# Altium project 220_energy_meter.PrjPCB
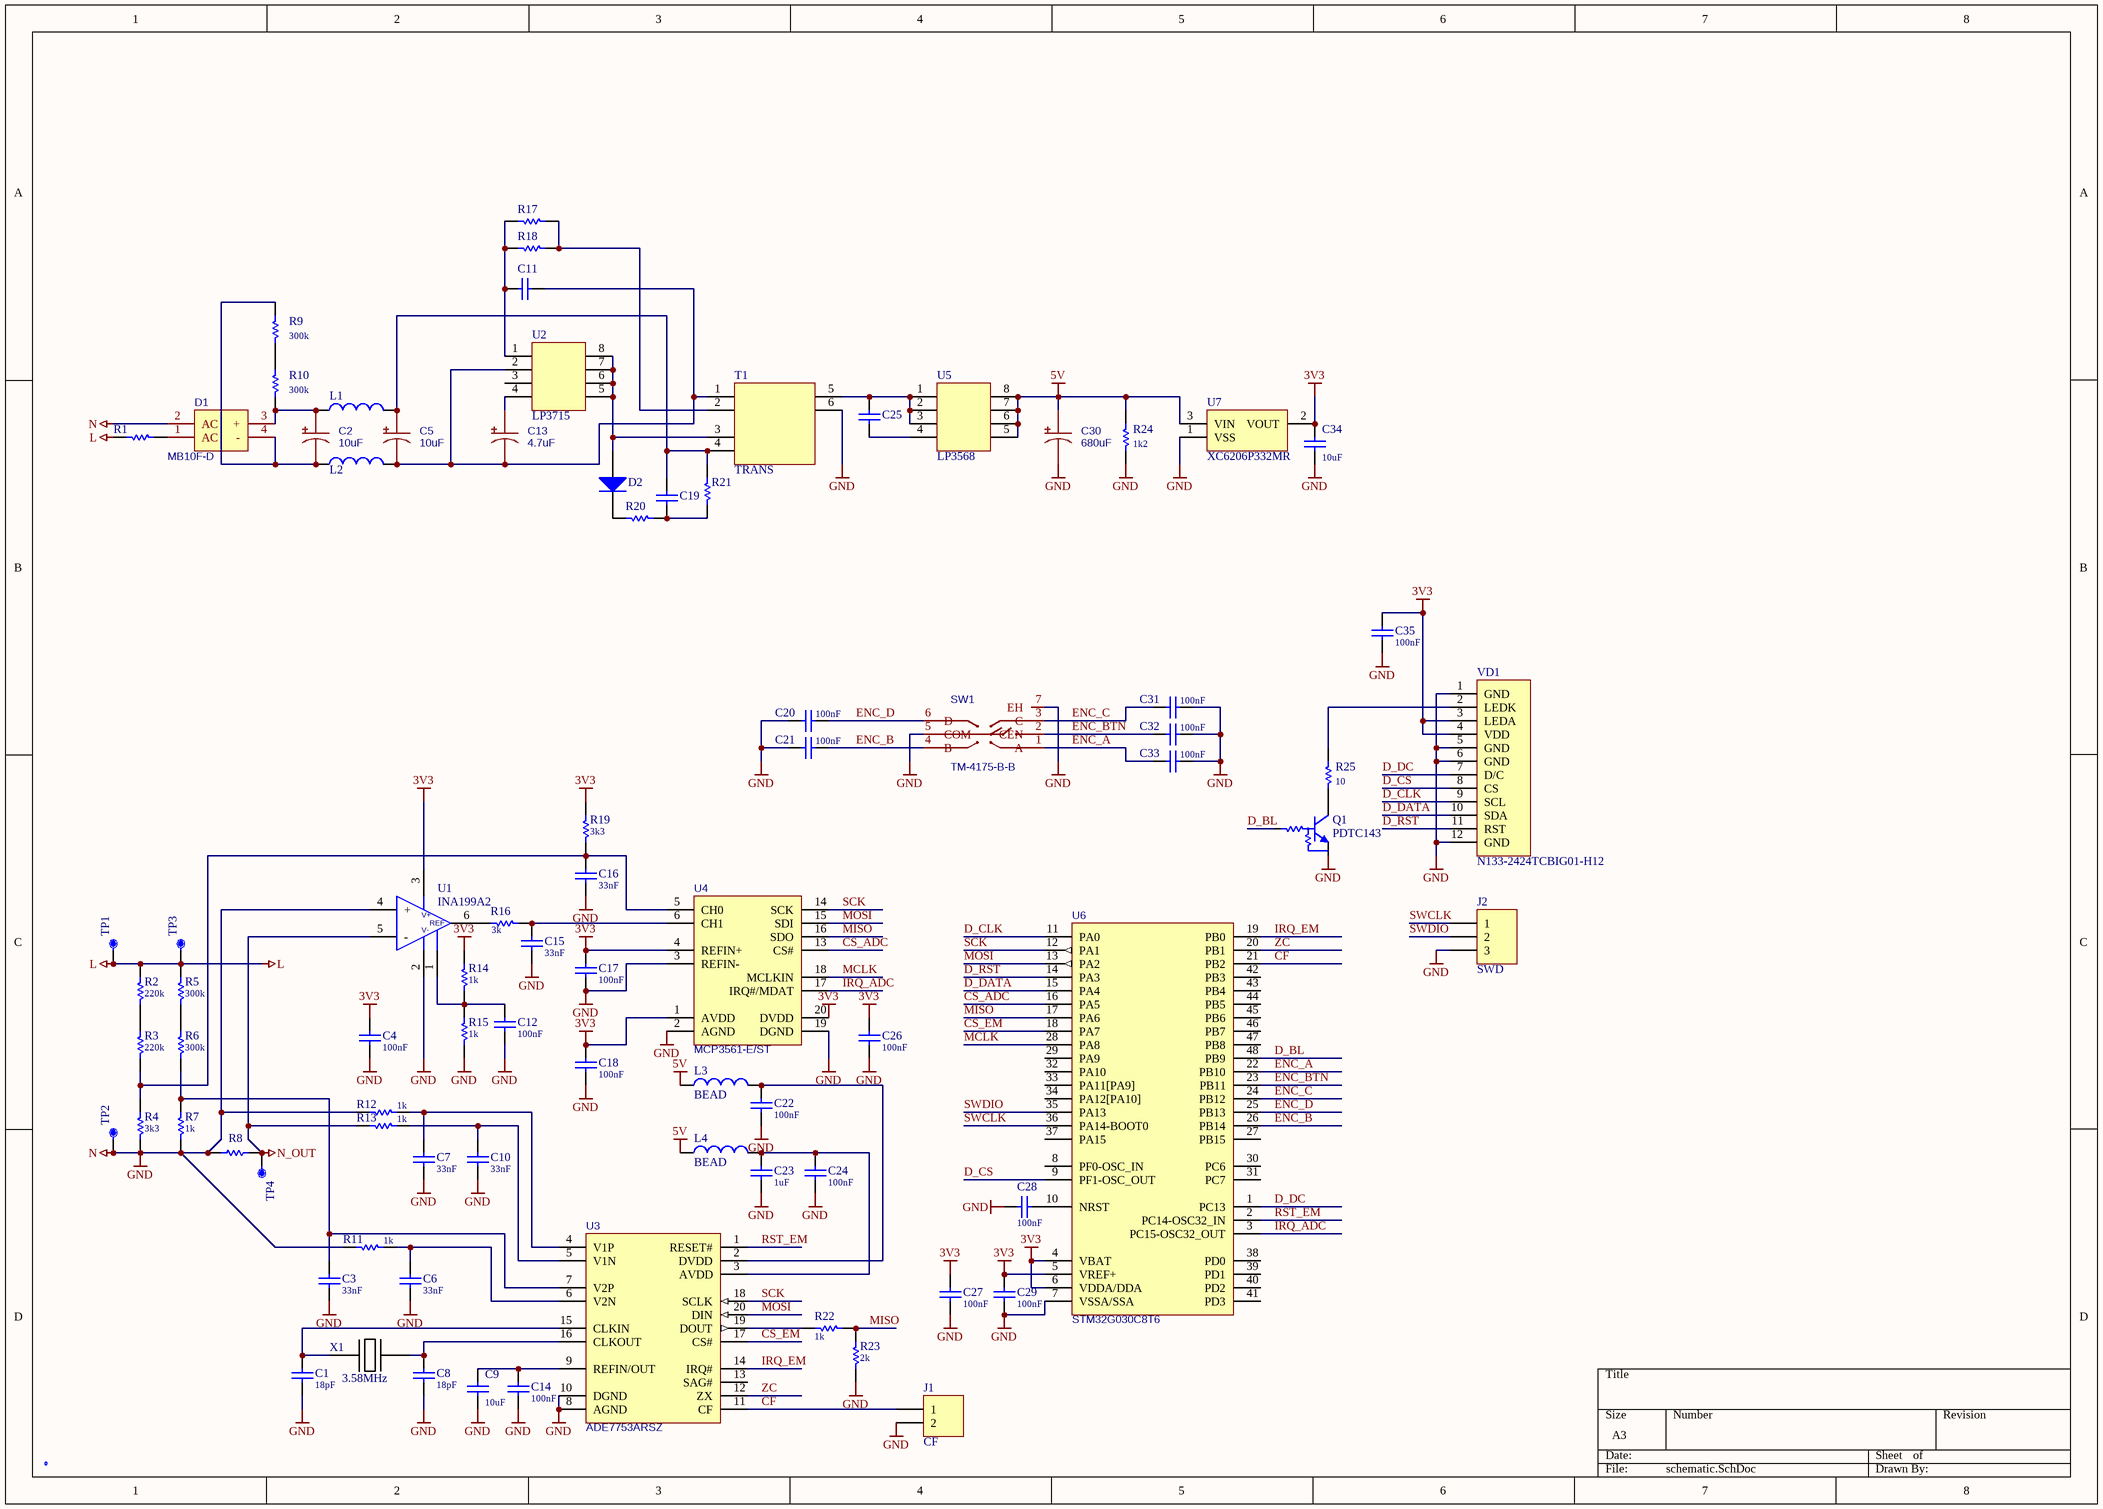
[diagram p0: schematic.SchDoc]
PRJ_ID: 220_EM; PRJ_VER: v2.0.0
1 sheet, 85 parts. Net scope: global (net labels, ports and power ports of the same name join across sheets).
Board file: board.PcbDoc

## Sheet schematic.SchDoc
size A3; SheetNumber: 6; SheetTotal: 29

### Parts
C1  18pF  [C0402]
C2  10uF  [CAP-TH_BD8.0-P3.50-D0.6-FD_1]  (no BOM)
C3  33nF  [C0402]
C4  100nF  [C0402]
C5  10uF  [CAP-TH_BD8.0-P3.50-D0.6-FD_1]  (no BOM)
C6  33nF  [C0402]
C7  33nF  [C0402]
C8  18pF  [C0402]
C9  10uF  [C1206]
C10  33nF  [C0402]
C11  (no value)  [C0603]  (no BOM)
C12  100nF  [C0402]
C13  4.7uF  [CAP-TH_BD4.0-P2]  (no BOM)
C14  100nF  [C0402]
C15  33nF  [C0402]
C16  33nF  [C0402]
C17  100nF  [C0402]
C18  100nF  [C0402]
C19  (no value)  [C1206]  (no BOM)
C20  100nF  [C0402]
C21  100nF  [C0402]
C22  100nF  [C0402]
C23  1uF  [C0603]
C24  100nF  [C0402]
C25  (no value)  [C0603]  (no BOM)
C26  100nF  [C0402]
C27  100nF  [C0402]
C28  100nF  [C0603]
C29  100nF  [C0402]
C30  680uF  [CAP-TH_BD6.3-P2.54]  (no BOM)
C31  100nF  [C0402]
C32  100nF  [C0402]
C33  100nF  [C0402]
C34  10uF  [C1206]
C35  100nF  [C0402]
D1  MB10F-D  [MINIDIP_4P-L4.7-W3.8-P2.50-LS7.0-BL]  (no BOM)
D2  1N4148WS  [SOD-123]  (value not drawn)  (no BOM)
J1  CF  [HDR-1X2_2.54]  (no BOM)
J2  SWD  [HDR-1X3_2.54]  (no BOM)
L1  (no value)  [IND_TH]  (no BOM)
L2  (no value)  [L0805]  (no BOM)
L3  BEAD  [L0402]
L4  BEAD  [L0402]
LOGO1  LOGO  [LOGO]  (value not drawn)  (no BOM)
Q1  PDTC143  [SOT-23]
R1  (no value)  [IND_TH]  (no BOM)
R2  220k  [R1206]
R3  220k  [R1206]
R4  3k3  [R0603]
R5  300k  [R1206]
R6  300k  [R1206]
R7  1k  [R0603]
R8  (no value)  [R2512-WIDE]
R9  300k  [R1206]
R10  300k  [R1206]
R11  1k  [R0603]
R12  1k  [R0603]
R13  1k  [R0603]
R14  1k  [R0603]
R15  1k  [R0603]
R16  3k  [R0603]
R17  (no value)  [R0603]  (no BOM)
R18  (no value)  [R0603]  (no BOM)
R19  3k3  [R0603]
R20  (no value)  [R0805]  (no BOM)
R21  (no value)  [R1206]  (no BOM)
R22  1k  [R0402]
R23  2k  [R0402]
R24  1k2  [R1206]  (no BOM)
R25  10  [R0603]
SW1  TM-4175-B-B  [SW-SMD_TM-4175-B-X]
T1  TRANS  [TRANSFORMER]  (no BOM)
TP1  (no value)  [TP2030_SMD]  (no BOM)
TP2  (no value)  [TP2030_SMD]  (no BOM)
TP3  (no value)  [TP2030_SMD]  (no BOM)
TP4  (no value)  [TP2030_SMD]  (no BOM)
U1  INA199A2  [SOT-363]
U2  LP3715  [SOIC-8]  (no BOM)
U3  ADE7753ARSZ  [SSOP-20]
U4  MCP3561-E/ST  [SSOP-20]
U5  LP3568  [SOIC-8]  (no BOM)
U6  STM32G030C8T6  [LQFP-48]
U7  XC6206P332MR  [SOT-23]
VD1  N133-2424TCBIG01-H12  [LCD_PICO_1.3]  (no BOM)
X1  3.58MHz  [HC-49S-SMD]

### Nets
3V3: C4.2 C17.2 C18.2 C26.2 C27.2 C29.2 C34.2 C35.2 R14.2 R19.1 U1.3(V+) U4.1(AVDD) U4.4(REFIN+) U4.20(DVDD) U6.4(VBAT) U6.5(VREF+) U6.6(VDDA/DDA) U7.2(VOUT) VD1.3(LEDA) VD1.4(VDD)
5V: C30.1 L3.1 L4.1 R24.2 U5.5 U5.6 U5.7 U5.8 U7.3(VIN)
GND: C1.1 C3.1 C4.1 C6.1 C7.1 C8.1 C9.1 C10.1 C12.1 C14.1 C15.1 C16.1 C17.1 C18.1 C20.2 C21.2 C22.1 C23.1 C24.2 C26.1 C27.1 C28.2 C29.1 C30.2 C31.1 C32.1 C33.1 C34.1 C35.1 D1.2(AC) J1.2 J2.3 Q1.2(E) R4.2 R7.2 R8.2 R11.2 R12.2 R15.1 R23.2 R24.1 SW1.5(COM) SW1.7(EH) T1.6 TP2.1 U1.2(GND) U1.4(+) U3.8(AGND) U3.10(DGND) U4.2(AGND) U4.3(REFIN-) U4.19(DGND) U6.7(VSSA/SSA) U7.1(VSS) VD1.1(GND) VD1.5(GND) VD1.6(GND) VD1.12(GND)  [also labelled N]
L: R1.2 R2.1 R5.1 TP1.1 TP3.1
N_OUT: R8.1 R13.2 TP4.1 U1.5(-)
CF: J1.1 U3.11(CF) U6.21(PB2)
CS_ADC: U4.13(CS#) U6.16(PA5)
CS_EM: U3.17(CS#) U6.18(PA7)
D_BL: Q1.1(B) U6.48(PB9)
D_CLK: U6.11(PA0) VD1.9(SCL)
D_CS: U6.9(PF1-OSC_OUT) VD1.8(CS)
D_DATA: U6.15(PA4) VD1.10(SDA)
D_DC: U6.1(PC13) VD1.7(D/C)
D_RST: U6.14(PA3) VD1.11(RST)
ENC_A: C33.2 SW1.1(A) U6.22(PB10)
ENC_B: C21.1 SW1.4(B) U6.26(PB14)
ENC_BTN: C32.2 SW1.2(CEN) U6.23(PB11)
ENC_C: C31.2 SW1.3(C) U6.24(PB12)
ENC_D: C20.1 SW1.6(D) U6.25(PB13)
IRQ_ADC: U4.17(IRQ#/MDAT) U6.3(PC15-OSC32_OUT)
IRQ_EM: U3.14(IRQ#) U6.19(PB0)
MCLK: U4.18(MCLKIN) U6.28(PA8)
MISO: R22.1 R23.1 U4.16(SDO) U6.17(PA6)
MOSI: U3.20(DIN) U4.15(SDI) U6.13(PA2)
RST_EM: U3.1(RESET#) U6.2(PC14-OSC32_IN)
SCK: U3.18(SCLK) U4.14(SCK) U6.12(PA1)
SWCLK: J2.1 U6.36(PA14-BOOT0)
SWDIO: J2.2 U6.35(PA13)
ZC: U3.12(ZX) U6.20(PB1)
NetC1_2: C1.2 U3.15(CLKIN) X1.1(X1)
NetC2_1: C2.1 D1.3(+) L1.2 R10.1
NetC2_2: C2.2 D1.4(-) L2.2 R9.2
NetC3_2: C3.2 R6.2 R7.1 U3.7(V2P)
NetC5_1: C5.1 C19.1 L1.1 R21.2 T1.4
NetC5_2: C5.2 C11.1 C13.2 L2.1 T1.1 U2.2
NetC6_2: C6.2 R11.1 U3.6(V2N)
NetC7_2: C7.2 R12.1 U3.4(V1P)
NetC8_2: C8.2 U3.16(CLKOUT) X1.2(X2)
NetC9_2: C9.2 C14.2 U3.9(REFIN/OUT)
NetC10_2: C10.2 R13.1 U3.5(V1N)
NetC11_2: C11.2 R17.2 R18.2 U2.1
NetC12_2: C12.2 R14.1 R15.2 U1.1(REF)
NetC13_1: C13.1 U2.4
NetC15_2: C15.2 R16.1 U4.6(CH1)
NetC16_2: C16.2 R3.2 R4.1 R19.2 U4.5(CH0)
NetC19_2: C19.2 R20.2 R21.1
NetC22_2: C22.2 L3.2 U3.2(DVDD)
NetC23_2: C23.2 C24.1 L4.2 U3.3(AVDD)
NetC25_1: C25.1 U5.4
NetC25_2: C25.2 T1.5 U5.1 U5.2 U5.3
NetC28_1: C28.1 U6.10(NRST)
NetD1_1: D1.1(AC) R1.1
NetD2_1: D2.1(A) T1.3 U2.5 U2.6 U2.7 U2.8
NetD2_2: D2.2(K) R20.1
NetQ1_3: Q1.3(C) R25.2
NetR2_2: R2.2 R3.1
NetR5_2: R5.2 R6.1
NetR9_1: R9.1 R10.2
NetR16_2: R16.2 U1.6(OUT)
NetR17_1: R17.1 R18.1 T1.2
NetR22_2: R22.2 U3.19(DOUT)
NetR25_1: R25.1 VD1.2(LEDK)

Not connected (* = marked no-connect by the designer): U2 3; U3 13(SAG#); U6 8(PF0-OSC_IN) 27(PB15) 29(PA9) 30(PC6) 31(PC7) 32(PA10) 33(PA11[PA9]) 34(PA12[PA10]) 37(PA15) 38(PD0) 39(PD1) 40(PD2) 41(PD3) 42(PB3) 43(PB4) 44(PB5) 45(PB6) 46(PB7) 47(PB8)

### Notes on the sheet
- (in symbol MCP65R41T-2402) V-

### Library data of the parts
C1 C7 C8 C10 = CAP: P/N: GRM1555C1H180JA01D; LCSC part number: C33149
C2 C5 = 220uF: 01EC4138MHT10uF400V
C3 C4 C6 C9 C11 C12 C14-C22 C24-C29 C31-C35 = CAP
C13 C30 = 220uF
C23 = CAP: 1uF 50V 0603; P/N: 0603B105K500NT; LCSC part number: C90540
D2 = US1M-13-F
J1 = Header 2
J2 = Header 3
L1 L2 = BLM18AG601SN1D
L3 L4 = BLM18AG601SN1D: BEAD 0402; P/N: CBG100505U600T; LCSC part number: C92615
Q1 = MMBT2222ALT1G: PDTC143XT,215; LCSC part number: C183011; P/N: PDTC143XT,215
R1-R25 = RES
T1 = Component_2
TP1-TP4 = TP_Dup1: LCSC part number: -; P/N: -
U1 = MCP65R41T-2402
U2 U5 = Component_1
U7 = Component_4_1
VD1 = Header 3: N133-2424TCBIG01-H12 19650 Waveshare
X1 = CRYSTAL 12MHZ 3.20mm x 2.50mm: 3.58MHz 20pF ±20ppm HC-49S
D1 = MB10F-D: LCSC part number: C908753; P/N: MB10F-D
SW1 = TM-4175-B-B: LCSC part number: C465996; P/N: TM-4175-B-B
U3 = ADE7753ARSZ: LCSC part number: C654528; P/N: ADE7753ARSZ